# EAGLE design uart_com (EAGLE 5.10)
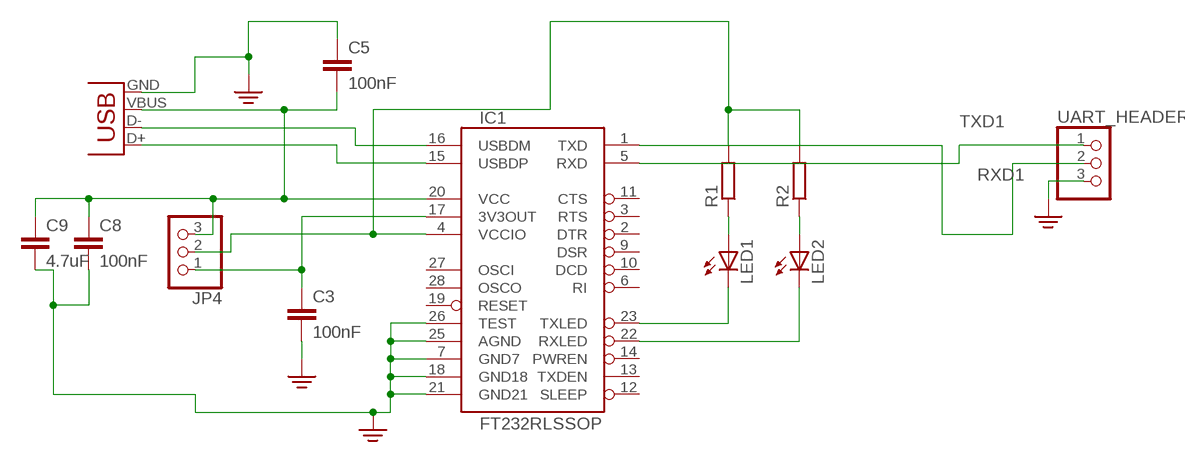
[diagram p0: schematic, sheet 1]

## Parts
C3  100nF  C-EUC0603K  [C0603K]
C5  100nF  C-EUC0603K  [C0603K]
C8  100nF  C-EUC0603K  [C0603K]
C9  4.7uF  C-EUC1206K  [C1206K]
IC1  FT232RLSSOP  [SSOP28DB]
JP4  PINHD-1X3  [1X03]
LED1  LEDCHIPLED_0805  [CHIPLED_0805]
LED2  LEDCHIPLED_0805  [CHIPLED_0805]
R1  R-EU_M0805  [M0805]
R2  R-EU_M0805  [M0805]
UART_HEADER  PINHD-1X3  [1X03]
X1  USB-SMD-NS  [USB-MINIB-NOSTOP]

## Nets
N$4: C3.1 IC1.17(3V3OUT) JP4.1
N$6: C5.2 C8.1 C9.1 IC1.20(VCC) JP4.3 X1.VBUS
N$8: IC1.16(USBDM) X1.D-
N$9: IC1.15(USBDP) X1.D+
N$13: IC1.23(TXLED) LED1.C
N$14: IC1.22(RXLED) LED2.C
N$15: LED1.A R1.1
N$16: LED2.A R2.1
N$18: IC1.4(VCCIO) JP4.2 R1.2 R2.2
PE: C3.2 C5.1 C8.2 C9.2 IC1.7(GND7) IC1.18(GND18) IC1.21(GND21) IC1.25(AGND) IC1.26(TEST) UART_HEADER.3 X1.GND
RXD1: IC1.1(TXD) UART_HEADER.2
TXD1: IC1.5(RXD) UART_HEADER.1
Unconnected: IC1.2(DTR) IC1.3(RTS) IC1.6(RI) IC1.9(DSR) IC1.10(DCD) IC1.11(CTS) IC1.12(SLEEP) IC1.13(TXDEN) IC1.14(PWREN) IC1.19(RESET) IC1.27(OSCI) IC1.28(OSCO)

## Library data of the parts
C3 C5 C8 C9 = rcl:C-EU: CAPACITOR, European symbol
IC1 = SparkFun:FT232RL: USB UART FT232RL 4th Generation USB UART (USB <-> Serial) Controller. Spark Fun Electronics SKU : COM-00650
JP4 UART_HEADER = pinhead:PINHD-1X3: PIN HEADER
LED1 LED2 = led:LED: LED OSRAM: - CHIPLED LG R971, LG N971, LY N971, LG Q971, LY Q971, LO R971, LY R971 LH N974, LH R974 LS Q976, LO Q976, LY Q976 LO Q996 - Hyper CHIPLED LW Q18S LB Q993, LB Q99A, LB R99A - SideLED LS A670, LO A670, LY A670, LG A670, LP A670 LB A673, LV A673, LT A673, LW A673 LH A674 LY A675 LS A676, LA A676, LO A676, LY A676, LW A676 LS A679, LY A679, LG A679 - Hyper Micro SIDELED® LS Y876, LA Y876, LO Y876, LY Y876 LT Y87S - SmartLED LW L88C, LW L88S LB L89C, LB L89S, LG L890 LS L89K, LO L89K, LY L89K LS L896, LA L896, LO L896, LY L896 - TOPLED LS T670, LO T670, LY T670, LG T670, LP T670 LSG T670, LSP T670, LSY T670, LOP T670, LYG T670 LG T671, LOG T671, LSG T671 LB T673, LV T673, LT T673, LW T673 LH T674 LS T676, LA T676, LO T676, LY T676, LB T676, LH T676, LSB T676, LW T676 LB T67C, LV T67C, LT T67C, LS T67K, LO T67K, LY T67K, LW E67C LS E67B, LA E67B, LO E67B, LY E67B, LB E67C, LV E67C, LT E67C LW T67C LS T679, LY T679, LG T679 LS T770, LO T770, LY T770, LG T770, LP T770 LB T773, LV T773, LT T773, LW T773 LH T774 LS E675, LA E675, LY E675, LS T675 LS T776, LA T776, LO T776, LY T776, LB T776 LHGB T686 LT T68C, LB T68C - Hyper Mini TOPLED® LB M676 - Mini TOPLED Santana® LG M470 LS M47K, LO M47K, LY M47K Source: http://www.osram.convergy.de LUXEON: - LUMILED® LXK2-PW12-R00, LXK2-PW12-S00, LXK2-PW14-U00, LXK2-PW14-V00 LXK2-PM12-R00, LXK2-PM12-S00, LXK2-PM14-U00 LXK2-PE12-Q00, LXK2-PE12-R00, LXK2-PE12-S00, LXK2-PE14-T00, LXK2-PE14-U00 LXK2-PB12-K00, LXK2-PB12-L00, LXK2-PB12-M00, LXK2-PB14-N00, LXK2-PB14-P00, LXK2-PB14-Q00 LXK2-PR12-L00, LXK2-PR12-M00, LXK2-PR14-Q00, LXK2-PR14-R00 LXK2-PD12-Q00, LXK2-PD12-R00, LXK2-PD12-S00 LXK2-PH12-R00, LXK2-PH12-S00 LXK2-PL12-P00, LXK2-PL12-Q00, LXK2-PL12-R00 Source: www.luxeon.com KINGBRIGHT: KA-3528ASYC Source: www.kingbright.com
R1 R2 = resistor:R-EU_: RESISTOR, European symbol
X1 = SparkFun:USB: USB Connectors USB-B-PTH is fully proven SKU : PRT-00139 USB-miniB is fully proven SKU : PRT-00587 USB-A-PCB is untested. USB-A-H is throughly reviewed, but untested. Spark Fun Electronics SKU : PRT-00437 USB-B-SMT is throughly reviewed, but untested. Needs silkscreen touching up. USB-A-S has not been used/tested USB-MB-H has not been used/tested

## Board
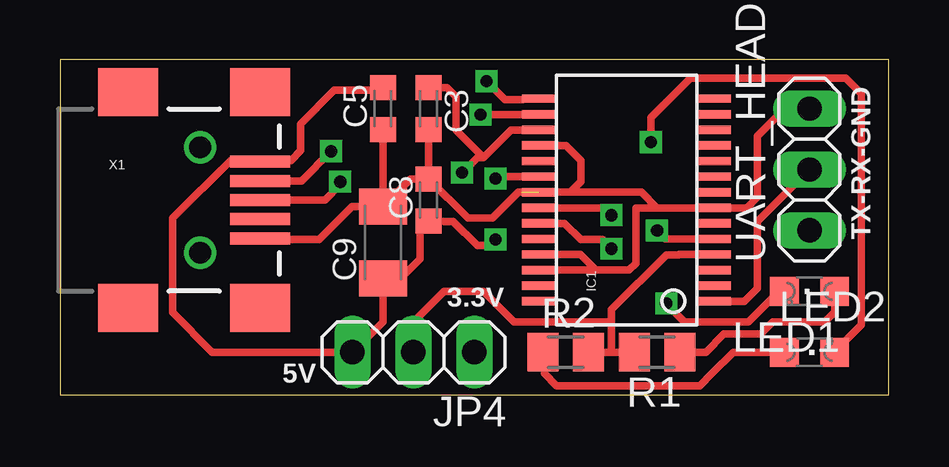
[diagram p1: board, top side]
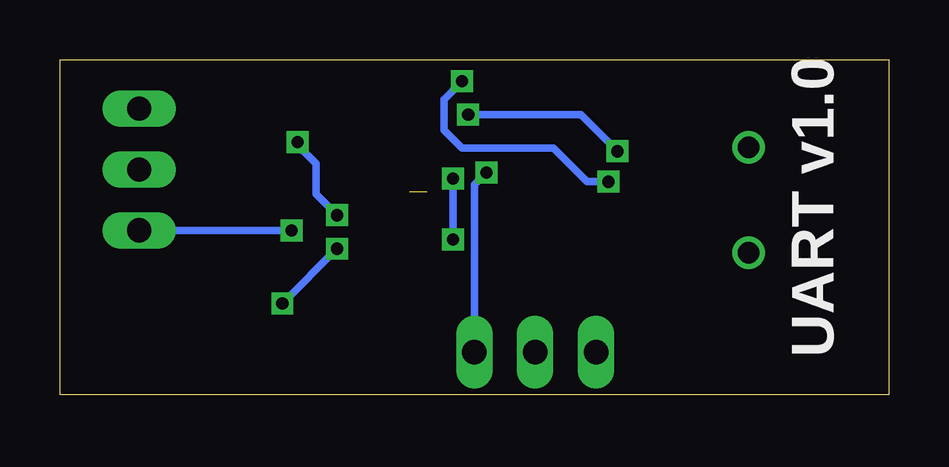
[diagram p2: board, bottom side, seen from below]

Size 34.54 x 13.97 mm. Coordinates in mm from the lower left corner, seen from the top.
Outline: 0,0 34.54,0 34.54,13.97 0,13.97 0,0
Copper layers (1*16): Top 0.035mm / dielectric 1.5mm / Bottom 0.035mm
Design rules "default *": minimum track width 8mil, minimum drill 20mil, track to track 8mil, track to pad 8mil, pad to pad 8mil, via to via 8mil, smd to smd 8mil, copper to edge 8mil, drill to drill 8mil, minimum pad ring 8mil, minimum via ring 8mil, stop-mask expansion 4mil, vias tented up to drill 0mil, thermal gap 10mil

### Footprints (pad centres in the part's own frame; a part is rotated, then mirrored left to right if it is on the bottom)
C0603K = smd 1.05 x 1.08: 1 -0.875,0; 2 0.875,0
C1206K = smd 1.5 x 2: 1 -1.5,0; 2 1.5,0
SSOP28DB = smd 0.348 x 1.397: 1 -4.225,-3.656; 2 -3.575,-3.656; 3 -2.925,-3.656; 4 -2.275,-3.656; 5 -1.625,-3.656; 6 -0.975,-3.656; 7 -0.325,-3.656; 8 0.325,-3.656; 9 0.975,-3.656; 10 1.625,-3.656; 11 2.275,-3.656; 12 2.925,-3.656; 13 3.575,-3.656; 14 4.225,-3.656; 15 4.225,3.656; 16 3.575,3.656; 17 2.925,3.656; 18 2.275,3.656; 19 1.625,3.656; 20 0.975,3.656; 21 0.325,3.656; 22 -0.325,3.656; 23 -0.975,3.656; 24 -1.625,3.656; 25 -2.275,3.656; 26 -2.925,3.656; 27 -3.575,3.656; 28 -4.225,3.656
1X03 = drill 1.016 long: 1 -2.54,0; 2 0,0; 3 2.54,0
CHIPLED_0805 = smd 1.2 x 1.2: A 0,-1.05; C 0,1.05
M0805 = smd 1.3 x 1.6: 1 -0.95,0; 2 0.95,0
USB-MINIB-NOSTOP = smd 2.5 x 0.5: D+ 2.5,0; D- 2.5,0.8; GND 2.5,-1.6; ID 2.5,-0.8; VBUS 2.5,1.6 | smd 2.5 x 2: G1 -3,-4.5; G2 -3,4.5; G3 2.5,4.5; G4 2.5,-4.5 | drill 0.9 pad 0.8 round: H1 0,2.2 | drill 0.9 pad 0.787 round: H2 0,-2.2

### Placement (x,y rotation side)
C3  15.37,11.94 270 top
C5  13.46,11.94 90 top
C8  15.37,8.13 90 top
C9  13.46,6.35 90 top
IC1  23.62,8.13 90 top
JP4  14.73,1.78 180 top
LED1  31.24,4.32 90 top
LED2  31.24,1.78 270 top
R1  24.89,1.78 180 top
R2  21.08,1.78 0 top
UART_HEADER  31.24,9.4 90 top
X1  5.84,8.13 0 top

### Tracks (layer width: path | path; a pad name or v marks a point on that pad's centre or on a via)
N$4  (via drill 0.51)
  Top 0.305: 17.65,9.91 18.8,11.05 IC1.17 | C3.1 16.14,12.81 16.51,12.45 16.51,11.05 17.65,9.91 | 17.65,9.91 17.4,9.91 v16.76,9.27
  Bottom 0.305: JP4.1 17.27,8.76 v16.76,9.27
N$6  (via drill 0.51)
  Top 0.305: 13.07,12.81 C5.2 13.35,12.7 11.43,12.7 10.03,11.3 10.03,10.18 9.63,9.78 8.39,9.78 | 8.39,9.78 X1.VBUS | 8.39,9.78 7.11,9.78 4.7,7.37 4.7,3.43 6.35,1.78 JP4.3 13.46,3.05 C9.1 14.2,4.85 15.01,5.66 15.01,6.9 C8.1 16.02,7.24 16.38,7.24 17.4,6.22 17.91,6.22 v18.16,6.48 | IC1.20 18.25,9.1 v18.16,9.02
  Bottom 0.305: v18.16,6.48 v18.16,9.02
N$8  (via drill 0.51)
  Top 0.305: v17.53,11.68 19.95,11.68 IC1.16 | X1.D- 10.07,8.93 v11.3,10.16
  Bottom 0.305: v17.53,11.68 12.83,11.68 v11.3,10.16
N$9  (via drill 0.51)
  Top 0.305: X1.D+ 11.05,8.13 11.68,8.76 v11.68,8.89 | v17.78,13.08 18.54,12.32 19.3,12.32 19.34,12.35 IC1.15
  Bottom 0.305: v11.68,8.89 12.57,8.89 13.97,10.29 17.78,10.29 18.54,11.05 18.54,12.32 v17.78,13.08
N$13  (via drill 0.51)
  Top 0.305: LED1.C 29.97,4.32 28.7,3.05 26.04,3.05 v25.27,3.81 | IC1.23 21.04,7.15 21.72,6.48 22.61,6.48 v22.99,6.1
  Bottom 0.305: v22.99,6.1 v25.27,3.81
N$14  (via drill 0.51)
  Top 0.305: LED2.C 32.29,1.81 33.4,2.92 33.4,12.57 32.77,13.21 26.29,13.21 24.64,11.56 v24.64,10.54 | IC1.22 22.68,7.8 v22.99,7.49
  Bottom 0.305: v24.64,10.54 24.64,10.41 23.88,9.65 23.88,8.38 v22.99,7.49
N$15
  Top 0.305: LED1.A 32.29,3.46 31.88,3.05 29.72,3.05 29.21,2.54 27.69,2.54 26.92,1.78 R1.1
N$16
  Top 0.305: LED2.A 28.07,1.78 27.18,0.89 26.67,0.38 20.7,0.38 20.19,0.89 20.19,1.72 R2.1
N$18
  Top 0.305: 22.99,1.78 R2.2 | 22.99,1.78 R1.2 | IC1.4 25.79,5.85 25.78,5.84 25.27,5.84 22.99,3.56 22.99,3.05 | 22.99,3.05 22.99,1.78 | JP4.2 14.73,3.05 16,4.32 17.65,4.32 18.92,3.05 22.99,3.05
PE  (1 unrouted)
  Top 0.305: C9.2 C5.1 | C8.2 C3.2 | C8.2 14.62,9 C9.2 | C9.2 12.17,7.85 10.79,6.48 8.39,6.48 X1.GND | IC1.18 21.09,10.4 21.72,9.78 21.72,8.89 21.28,8.45 | 21.28,8.45 IC1.21 | 24.89,7.8 24,7.8 24,5.49 23.72,5.21 23.24,5.2 22.35,5.2 | 24.89,7.8 IC1.7 28.63,7.8 29.08,8.26 29.08,10.79 30.23,11.94 UART_HEADER.3 | 21.09,5.85 IC1.25 21.7,5.85 22.35,5.2 | C8.2 17,7.37 18.03,7.37 19.12,8.45 19.25,8.45 | IC1.26 22.35,5.2 | 21.28,8.45 24.24,8.45 24.89,7.8
RXD1
  Top 0.305: UART_HEADER.2 29.08,7.24 29.08,4.45 28.54,3.9 IC1.1
TXD1  (via drill 0.51)
  Top 0.305: IC1.5 25.25,6.5 v24.89,6.86
  Bottom 0.305: v24.89,6.86 UART_HEADER.1

### Text on the board
tPlace: TX-RX-GND | 3.3V | 5V
bPlace: UART v1.0